# Altium schematic sheet USB Hub.SchDoc
size A; SheetNumber: 3; SheetTotal: 4; CompanyName: Gamber-Johnson LLC; Organization: CD Cell
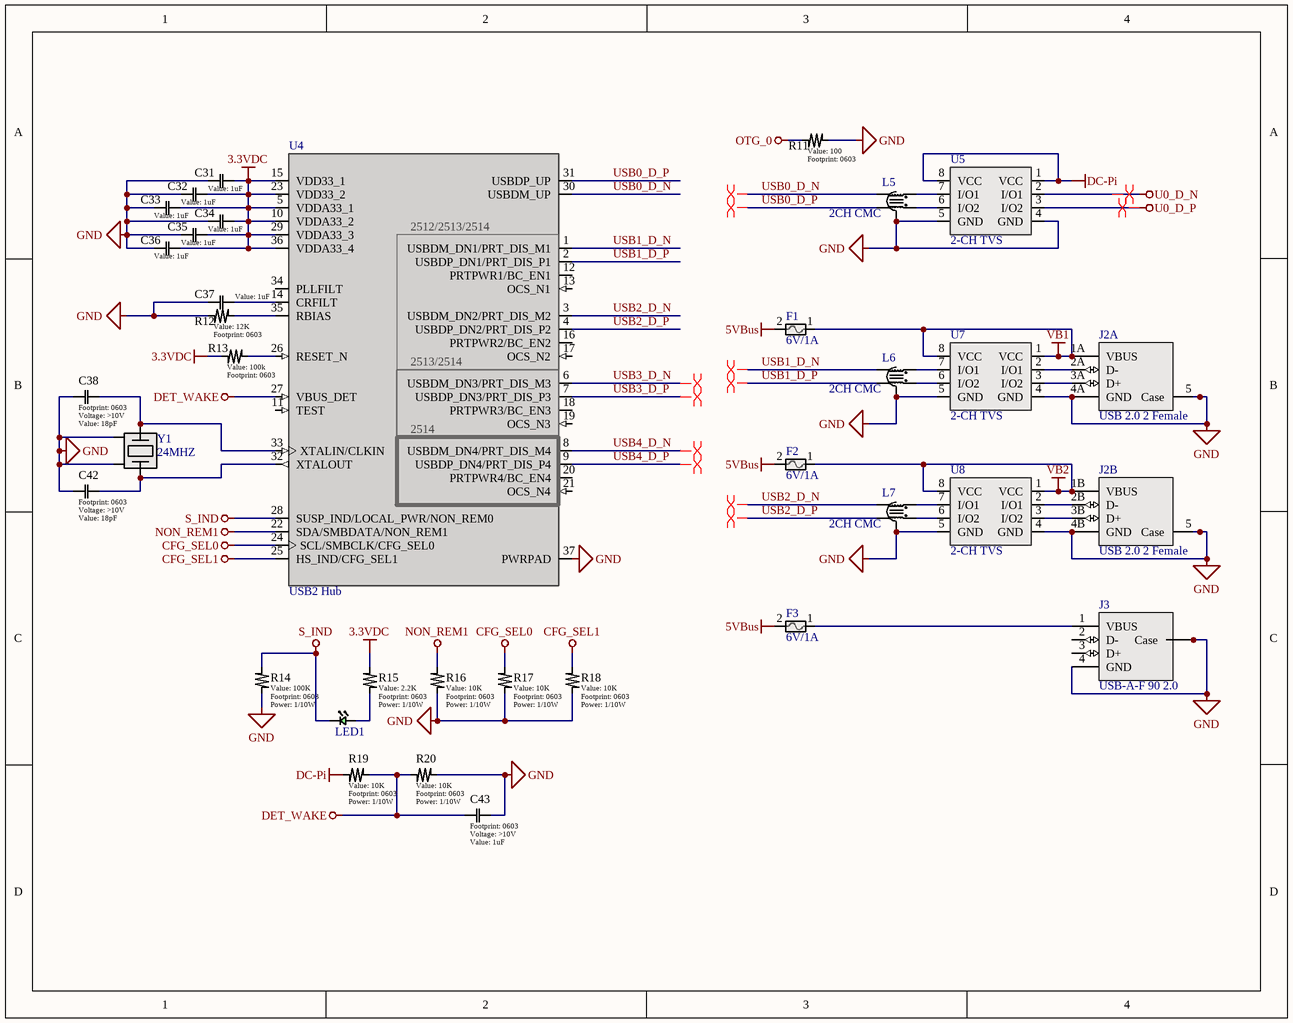
[diagram p0: USB Hub.SchDoc]

## Parts
C31  value 1uF  [0603]  (hidden comment: Generic Capacitor)
C32  value 1uF  [0603]  (hidden comment: Generic Capacitor)
C33  value 1uF  [0603]  (hidden comment: Generic Capacitor)
C34  value 1uF  [0603]  (hidden comment: Generic Capacitor)
C35  value 1uF  [0603]  (hidden comment: Generic Capacitor)
C36  value 1uF  [0603]  (hidden comment: Generic Capacitor)
C37  value 1uF  [0603]  (hidden comment: Generic Capacitor)
C38  value 18pF  Voltage: >10V  [0603]  (hidden comment: Generic Capacitor)
C42  value 18pF  Voltage: >10V  [0603]  (hidden comment: Generic Capacitor)
C43  value 1uF  Voltage: >10V  [0603]  (hidden comment: Generic Capacitor)
F1  6V/1A  [0805]
F2  6V/1A  [0805]
F3  6V/1A  [0805]
J2  USB 2.0 2 Female  [907-111A1022D10200]  (parts A,B of 2)
J3  USB-A-F 90 2.0  [Molex_67329-8000]
L5  2CH CMC  [SMD-6-2CH]
L6  2CH CMC  [SMD-6-2CH]
L7  2CH CMC  [SMD-6-2CH]
LED1  LTST-C191KGKT  [0603 (1608 Metric) Concave]  (value not drawn)
R11  value 100  [0603]  (hidden comment: Generic Resistor)
R12  value 12K  [0603]  (hidden comment: Generic Resistor)
R13  value 100k  [0603]  (hidden comment: Generic Resistor)
R14  value 100K  Power: 1/10W  [0603]  (hidden comment: Generic Resistor)
R15  value 2.2K  Power: 1/10W  [0603]  (hidden comment: Generic Resistor)
R16  value 10K  Power: 1/10W  [0603]  (hidden comment: Generic Resistor)
R17  value 10K  Power: 1/10W  [0603]  (hidden comment: Generic Resistor)
R18  value 10K  Power: 1/10W  [0603]  (hidden comment: Generic Resistor)
R19  value 10K  Power: 1/10W  [0603]  (hidden comment: Generic Resistor)
R20  value 10K  Power: 1/10W  [0603]  (hidden comment: Generic Resistor)
U4  USB2 Hub  [36-QFN (6x6)]
U5  2-CH TVS  [8-SOIC]
U7  2-CH TVS  [8-SOIC]
U8  2-CH TVS  [8-SOIC]
Y1  24MHZ  [SMD2520-4P]

## Nets
3.3VDC: C31.2 C32.2 C33.2 C34.2 C35.2 C36.2 R13.1 R15.1 U4.5(VDDA33_1) U4.10(VDDA33_2) U4.15(VDD33_1) U4.23(VDD33_2) U4.29(VDDA33_3) U4.36(VDDA33_4)
5VBus: F1.2 F2.2 F3.2
CFG_SEL0: R17.1 U4.24(SCL/SMBCLK/CFG_SEL0)
CFG_SEL1: R18.1 U4.25(HS_IND/CFG_SEL1)
DC-Pi: R19.1 U5.1(VCC) U5.8(VCC)
DET_WAKE: C43.1 R19.2 R20.1 U4.27(VBUS_DET)
GND: C31.1 C32.1 C33.1 C34.1 C35.1 C36.1 C37.1 C38.1 C42.1 C43.2 J2.4A(GND) J2.4B(GND) J2.5(Case) J3.4(GND) J3.5(Case) J3.6(Case) J3.7(Case) J3.8(Case) L5.5 L5.6 L6.5 L6.6 L7.5 L7.6 R11.2 R12.1 R14.2 R16.2 R17.2 R18.2 R20.2 U4.37(PWRPAD) U5.4(GND) U5.5(GND) U7.4(GND) U7.5(GND) U8.4(GND) U8.5(GND) Y1.2(GND) Y1.4(GND)
NON_REM1: R16.1 U4.22(SDA/SMBDATA/NON_REM1)
OTG_0: R11.1
S_IND: LED1.1(Cathode) R14.1 U4.28(SUSP_IND/LOCAL_PWR/NON_REM0)
U0_D_N: U5.2(I/O1)
U0_D_P: U5.3(I/O2)
VB1: F1.1 J2.1A(VBUS) U7.1(VCC) U7.8(VCC)
VB2: F2.1 J2.1B(VBUS) U8.1(VCC) U8.8(VCC)
USB0_D_N: L5.4 U4.30(USBDM_UP)
USB0_D_P: L5.3 U4.31(USBDP_UP)
USB1_D_N: L6.4 U4.1(USBDM_DN1/PRT_DIS_M1)
USB1_D_P: L6.3 U4.2(USBDP_DN1/PRT_DIS_P1)
USB2_D_N: L7.4 U4.3(USBDM_DN2/PRT_DIS_M2)
USB2_D_P: L7.3 U4.4(USBDP_DN2/PRT_DIS_P2)
USB3_D_N: U4.6(USBDM_DN3/PRT_DIS_M3)
USB3_D_P: U4.7(USBDP_DN3/PRT_DIS_P3)
USB4_D_N: U4.8(USBDM_DN4/PRT_DIS_M4)
USB4_D_P: U4.9(USBDP_DN4/PRT_DIS_P4)
NetC37_2: C37.2 U4.14(CRFILT)
NetC38_2: C38.2 U4.33(XTALIN/CLKIN) Y1.1
NetC42_2: C42.2 U4.32(XTALOUT) Y1.3
NetF3_1: F3.1 J3.1(VBUS)
NetJ2_2A: J2.2A(D-) U7.2(I/O1)
NetJ2_2B: J2.2B(D-) U8.2(I/O1)
NetJ2_3A: J2.3A(D+) U7.3(I/O2)
NetJ2_3B: J2.3B(D+) U8.3(I/O2)
NetL5_1: L5.1 U5.7(I/O1)
NetL5_2: L5.2 U5.6(I/O2)
NetL6_1: L6.1 U7.7(I/O1)
NetL6_2: L6.2 U7.6(I/O2)
NetL7_1: L7.1 U8.7(I/O1)
NetL7_2: L7.2 U8.6(I/O2)
NetLED1_2: LED1.2(Anode) R15.2
NetR12_2: R12.2 U4.35(RBIAS)
NetR13_2: R13.2 U4.26(RESET_N)

Not connected (* = marked no-connect by the designer): J3 2(D-) 3(D+); U4 11(TEST) 12(PRTPWR1/BC_EN1) 13(OCS_N1) 16(PRTPWR2/BC_EN2) 17(OCS_N2) 18(PRTPWR3/BC_EN3) 19(OCS_N3) 20(PRTPWR4/BC_EN4) 21(OCS_N4) 34(PLLFILT)

## Layout directives
differential pair: U0_D_N, U0_D_P, USB0_D_N, USB0_D_P, USB1_D_N, USB1_D_P, USB2_D_N, USB2_D_P, USB3_D_N, USB3_D_P, USB4_D_N, USB4_D_P

## Notes on the sheet
- REV
- REVISIONS
- DATE
- DESCRIPTION
- BY
- UNLESS OTHERWISE SPECIFIED, DRAWING DEFINITIONS AND TOLERANCES SHALL BE FOUND UNDER SUPPLIER STANDARDS SS-001. THIS PART AND ALL COMPONENTS OF IT MUST BE RoHS & REACH COMPLIANT. A CERTIFICATE OF COMPLIANCE MUST BE PROVIDED UPON REQUEST.
- ALL INFORMATION ON THIS DOCUMENT IS THE SOLE PROPERTY OF GAMBER-JOHNSON AND SHALL NOT BE COPIED, REPRODUCED, USED OR DISCLOSED IN WHOLE OR IN PART WITHOUT THE WRITTEN CONSENT OF GAMBER-JOHNSON
- TOLERANCES
  .00 ± .060
  .000 ± .020
  .0000 ± .005
  ANGELS ± 1°
- DRAWN BY:
- PROJECT NUMBER:
- SHEET TITLE:
- SHEET
- OF
- DATE:
- LOCATION:
- ASSEMBLY NUMBER
- SIZE
- GAMBER-JOHNSON LLC
  5001 Joerns Dr
  STEVENS POINT, WI 54481
  +1 (715) 344-5209
- A
- (in symbol USB251xBI-AEZG) 2512/2513/2514; 2513/2514; 2514

## Library data of the parts
C31-C37 = Generic Capacitor: Voltage: >10V; Tolerance: 10%
C38 C42 C43 = Generic Capacitor: Tolerance: 10%
F1-F3 = 0ZCK0100FF2E: Polymeric PTC Resettable Fuse 6V 1 A Ih Surface Mount 0805 (2012 Metric), Concave; Manufacturer: Bel; Max Current Rating: 40A; Hold Current: 1A; Trip Current: 1.95A; Time to Trip: 0.3s; Supplier 1: Digi-Key; Supplier Part Number 1: 507-1815-1-ND; Manufacturer Part Number: 0ZCK0100FF2E; RoHS: Yes; Category: PTC Resettable Fuses; Stock 1: 74738; Pricing 1: 1=0.27000, 5=0.26600, 10=0.25400, 50=0.22620, 100=0.21060, 250=0.18720, 500=0.15600, 1000=0.14820 (USD); Mount: Surface Mount; Case/Package: 0805; Case Code (Metric): 2012; Case Code (Imperial): 0805; Contact Plating: Tin,Matte; Min Operating Temperature: -40°C; Max Operating Temperature: 85°C; Package Quantity: 1; Packaging: Tape and Reel; RoHS Compliant: Yes; ComponentLink1URL: https://datasheet.ciiva.com/18550/0zck-18550620.pdf?src-supplier=Digi-Key; ComponentLink1Description: https://datasheet.ciiva.com/18550/0zck-18550620.pdf?src-supplier=Digi-Key; ComponentLink2URL: https://datasheet.ciiva.com/18550/0zck-18550621.pdf?src-supplier=Digi-Key; ComponentLink2Description: https://datasheet.ciiva.com/18550/0zck-18550621.pdf?src-supplier=Digi-Key; ComponentLink3URL: https://datasheet.ciiva.com/18550/0zck-18550622.pdf?src-supplier=Digi-Key; ComponentLink3Description: https://datasheet.ciiva.com/18550/0zck-18550622.pdf?src-supplier=Digi-Key
J2 = 907-111A1022D10200: USB 2.0 2 8 Female Type-A Plugin USB Connectors ROHS; LCSC PN: C12049
J3 = 673298000: USB 2.0 1 Side insertion 4P Female Type-A Plugin; LCSC PN: C588410
L5-L7 = ICMEF112P350MFR: 35Ω@100MHz -40℃~+85℃ 4Ω 5V 2 100mA SMD Common Mode Filters ROHS; LCSC PN: C396460; Supplier 1: Mouser; Supplier Part Number 1: 710-748020024
LED1 = CMP-013-000000-1: LED Uni-Color Green 574nm 2-Pin Chip LED T/R; Manufacturer 1: Vishay Lite-On; Number of Elements: 1; Viewing Angle: 130°; Lens Transparency: Clear; Power Dissipation: 75mW; Test Current: 20mA; Lens Style: Rectangular,Colorless; Reverse Voltage: 5V; Lens Color: Colorless; Forward Current: 30mA; Dominant Wavelength: 571nm; Forward Voltage: 2V; Luminous Intensity: 35mcd; Case Code (Imperial): 0603; Width: 0.8mm; Depth: 0.8mm; Case Code (Metric): 1608; Packaging: Tape and Reel; Number of LEDs: 1; Lead Free: Lead Free; Package Quantity: 1; Illumination Color: Green; Design Item ID: LTST-C191KGKT; Color: Green; Mount: Surface Mount; Source: Diodes.SchLib; Radiation Hardening: No; Wavelength: 574nm; RoHS: Yes; Max Power Dissipation: 75mW; RoHS Compliant: Yes; Power Rating: 75mW; Case/Package: 0603; Length: 1.6mm; Component Type: Standard; Number of Pins: 2; Height: 0.55mm; Stock 1: 4150; Pin Count: 2; ComponentLink1Description: https://datasheet.ciiva.com/2109/ltst-c191kgkt-2109973.pdf?src-supplier=Digi-Key; Manufacturer Part Number 1: LTST-C191KGKT; Category: LEDs; Min Operating Temperature: -55°C; ComponentLink1URL: https://datasheet.ciiva.com/2109/ltst-c191kgkt-2109973.pdf?src-supplier=Digi-Key; Max Operating Temperature: 85°C; Pricing 1: 50=0.14800, 250=0.06800, 500=0.06400, 1250=0.05400, 2500=0.05100 (USD)
R11-R13 = Generic Resistor: Tolerance: 1%; Power: 1/10W
R14-R20 = Generic Resistor: Tolerance: 1%
U4 = USB251xBI-AEZG: USB Hub Controller USB 2.0 USB Interface 36-QFN _6x6_; MF: Microchip; MP: USB2514BI-AEZG; Digi-Key_Purchase_URL: https://www.digikey.com/product-detail/en/microchip-technology/USB2514BI-AEZG/USB2514BI-AEZG-ND/2258528?utm_source=snapeda&utm_medium=aggregator&utm_campaign=symbol; Digi-Key_Part_Number: USB2514BI-AEZG-ND; Package: QFN-36 Microchip; SnapEDA_Link: https://www.snapeda.com/parts/USB2514BI-AEZG/Microchip/view-part/48397/?ref=snap; Value: *; LCSC PN: C16251
U5 U7 U8 = USB6B1RL: TVS DIODE 5.25VWM 8-SOIC; Mfr_Name: STMicroelectronics; RefDes: RefDes; Type: Type; Supplier 1: Future Electronics; Supplier Part Number 1: 5702279; LCSC PN: C10508
Y1 = CM4024M00020001: 24MHz 20pF ±10ppm ±30ppm SMD-2520-4P Crystals ROHS; LCSC PN: C7294628